# Altium schematic sheet Sheet1.SchDoc
size A3; SheetNumber: 1; SheetTotal: 1
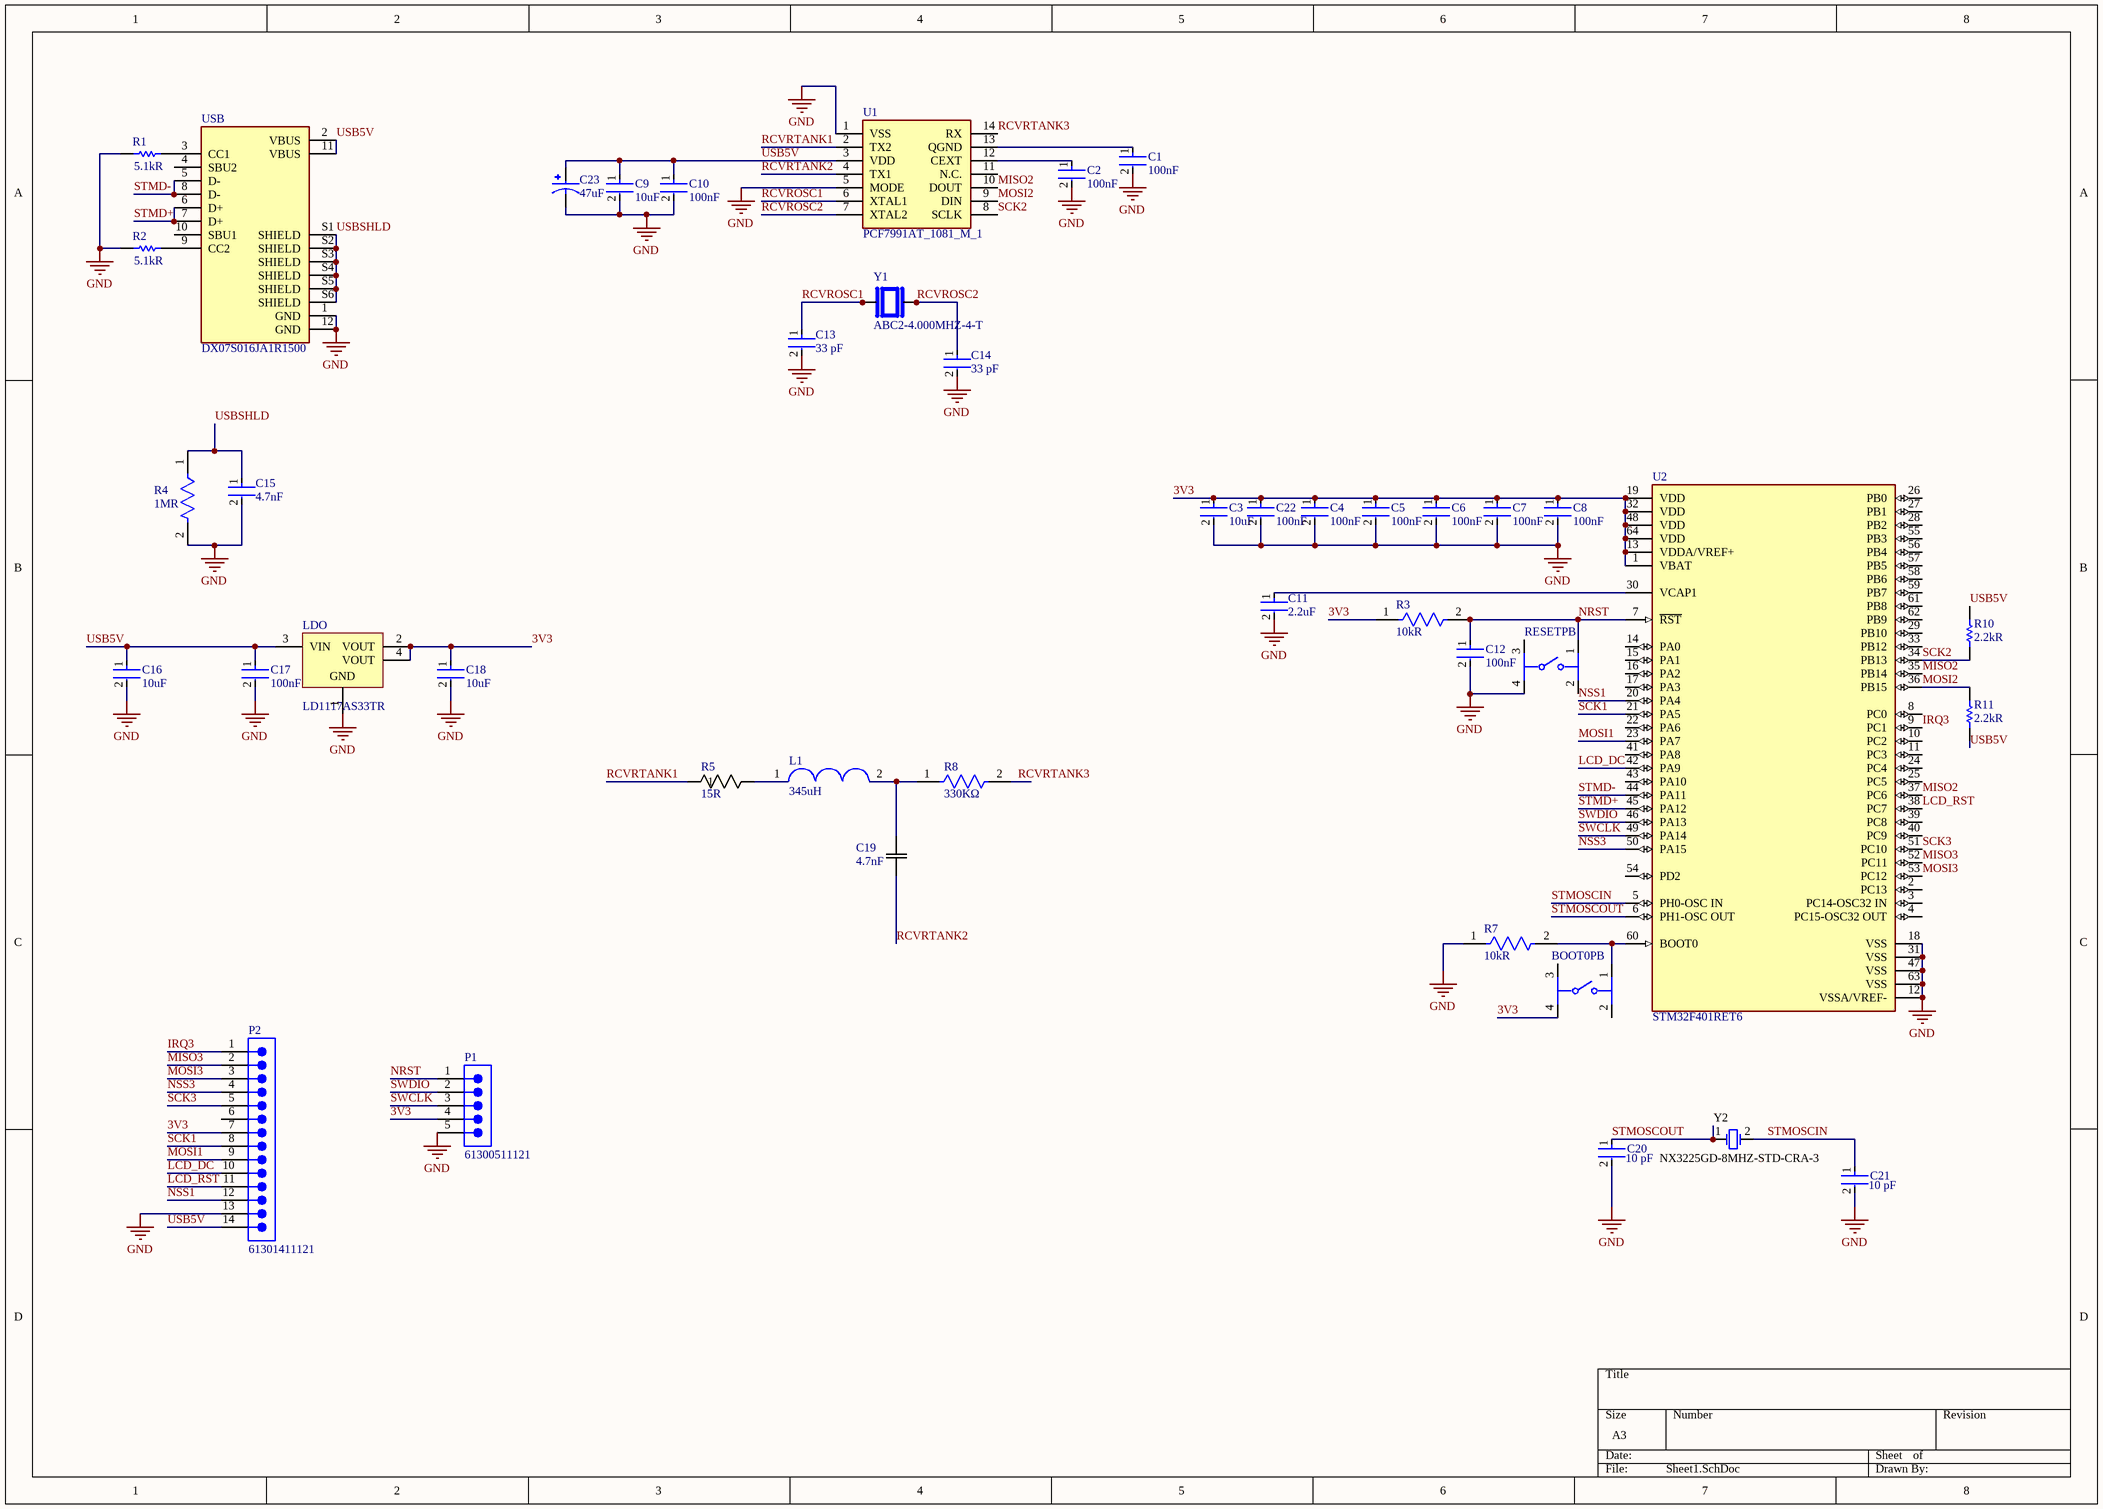
[diagram p0: Sheet1.SchDoc]

## Parts
BOOT0PB  PTS647SM38SMTR2LFS  [FP-PTS647SM38SMTR2LFS-MFG]  (value not drawn)
C1  Capacitance: 100nF  [FP-C0603C-CF-MFG]  (hidden comment: C0603C104K5RACTU)
C2  Capacitance: 100nF  [FP-C0603C-CF-MFG]  (hidden comment: C0603C104K5RACTU)
C3  Capacitance: 10uF  [FP-GRM188-0_2-IPC_C]  (hidden comment: GRM188R6YA106MA73D)
C4  Capacitance: 100nF  [FP-C0603C-CF-MFG]  (hidden comment: C0603C104K5RACTU)
C5  Capacitance: 100nF  [FP-C0603C-CF-MFG]  (hidden comment: C0603C104K5RACTU)
C6  Capacitance: 100nF  [FP-C0603C-CF-MFG]  (hidden comment: C0603C104K5RACTU)
C7  Capacitance: 100nF  [FP-C0603C-CF-MFG]  (hidden comment: C0603C104K5RACTU)
C8  Capacitance: 100nF  [FP-C0603C-CF-MFG]  (hidden comment: C0603C104K5RACTU)
C9  Capacitance: 10uF  [FP-GRM188-0_2-IPC_C]  (hidden comment: GRM188R6YA106MA73D)
C10  Capacitance: 100nF  [FP-C0603C-CF-MFG]  (hidden comment: C0603C104K5RACTU)
C11  Capacitance: 2.2uF  [FP-CL10-IPC_A]  (hidden comment: CL10A225KO8NNNC)
C12  Capacitance: 100nF  [FP-C0603C-CF-MFG]  (hidden comment: C0603C104K5RACTU)
C13  value 33 pF  [FP-C0603C-CF-MFG]  (hidden comment: C0603C330J5GACTU)
C14  value 33 pF  [FP-C0603C-CF-MFG]  (hidden comment: C0603C330J5GACTU)
C15  Capacitance: 4.7nF  [FP-GRM188-0_1-e0_2_0_5-MFG]  (hidden comment: GRM1885C1H472JA01D)
C16  Capacitance: 10uF  [FP-GRM188-0_2-IPC_C]  (hidden comment: GRM188R6YA106MA73D)
C17  Capacitance: 100nF  [FP-C0603C-CF-MFG]  (hidden comment: C0603C104K5RACTU)
C18  Capacitance: 10uF  [FP-GRM188-0_2-IPC_C]  (hidden comment: GRM188R6YA106MA73D)
C19  Parameter 1: 4.7nF  [CAPC340180_110N_KEM]  (hidden comment: C1206C472FBGACTU)
C20  Capacitance: 10 pF  [FP-C0603C-CF-MFG]  (hidden comment: C0603C100J5GACTU)
C21  Capacitance: 10 pF  [FP-C0603C-CF-MFG]  (hidden comment: C0603C100J5GACTU)
C22  Capacitance: 100nF  [FP-C0603C-CF-MFG]  (hidden comment: C0603C104K5RACTU)
C23  value 47uF  [CAP_EEEFK1C470P]  (hidden comment: EEEFK1C470P)
L1  Parameter 1: 345uH  [CP-345UH-ID20]  (hidden comment: CP-345UH-ID20)
LDO  LD1117AS33TR  [SOT-223_M]
P1  61300511121  [61300511121]
P2  61301411121  [61301411121]
R1  Parameter 1: 5.1kR  [RESC1608X55X25ML10T15]  (hidden comment: RC0603FR-075K1L)
R2  Parameter 1: 5.1kR  [RESC1608X55X25ML10T15]  (hidden comment: RC0603FR-075K1L)
R3  Resistance: 10kR  [FP-RC0603-0_55-IPC_C]  (hidden comment: RC0603FR-0710KL)
R4  Resistance: 1MR  [FP-ERJ3EK-IPC_C]  (hidden comment: ERJ-3EKF1004V)
R5  Parameter 1: 15R  [RES_352115RFT_TEC]  (hidden comment: 352115RFT)
R7  Resistance: 10kR  [FP-RC0603-0_55-IPC_C]  (hidden comment: RC0603FR-0710KL)
R8  Resistance: 330KΩ  [FP-CRGCQ1206-IPC_C]  (hidden comment: CRGCQ1206F330K)
R10  Resistance: 2.2kR  [RESC1608X55X25LL10T15]  (hidden comment: RC0603FR-072K2L)
R11  Resistance: 2.2kR  [RESC1608X55X25LL10T15]  (hidden comment: RC0603FR-072K2L)
RESETPB  PTS647SM38SMTR2LFS  [FP-PTS647SM38SMTR2LFS-MFG]  (value not drawn)
U1  PCF7991AT_1081_M_1  [SOIC127P600X175-14N]
U2  STM32F401RET6  [FP-LQFP64-5W-MFG]
USB  DX07S016JA1R1500  [JAE_DX07S016JA1R1500]
Y1  ABC2-4.000MHZ-4-T  [XTAL_ABC2-4.000MHZ-4-T]
Y2  NX3225GD-8MHZ-STD-CRA-3  [NDK-NX3225GD-8MHZ-STD-CRA-3_V]

## Nets
GND: C1.2 C2.2 C3.2 C4.2 C5.2 C6.2 C7.2 C8.2 C9.2 C10.2 C11.2 C12.2 C13.2 C14.2 C15.2 C16.2 C17.2 C18.2 C20.2 C21.2 C22.2 C23.2 LDO.1(GND) P1.5 P2.13 R1.1 R2.1 R4.2 R7.1 RESETPB.4 U1.1(VSS) U1.5(MODE) U2.12(VSSA/VREF-) U2.18(VSS) U2.31(VSS) U2.47(VSS) U2.63(VSS) USB.1(GND) USB.12(GND)
3V3: BOOT0PB.4 C3.1 C4.1 C5.1 C6.1 C7.1 C8.1 C18.1 C22.1 LDO.2(VOUT) LDO.4(VOUT) P1.4 P2.7 R3.1 U2.1(VBAT) U2.13(VDDA/VREF+) U2.19(VDD) U2.32(VDD) U2.48(VDD) U2.64(VDD)
IRQ3: P2.1 U2.9(PC1)
LCD_DC: P2.10 U2.42(PA9)
LCD_RST: P2.11 U2.38(PC7)
MISO2: U1.10(DOUT) U2.35(PB14) U2.37(PC6)
MISO3: P2.2 U2.52(PC11)
MOSI1: P2.9 U2.23(PA7)
MOSI2: R11.2 U1.9(DIN) U2.36(PB15)
MOSI3: P2.3 U2.53(PC12)
NRST: C12.1 P1.1 R3.2 RESETPB.1 U2.7(~{RST})
NSS1: P2.12 U2.20(PA4)
NSS3: P2.4 U2.50(PA15)
RCVROSC1: C13.1 U1.6(XTAL1) Y1.1 Y1.4
RCVROSC2: C14.1 U1.7(XTAL2) Y1.2 Y1.3
RCVRTANK1: R5.1 U1.2(TX2)
RCVRTANK2: C19.1 U1.4(TX1)
RCVRTANK3: R8.2 U1.14(RX)
SCK1: P2.8 U2.21(PA5)
SCK2: R10.1 U1.8(SCLK) U2.34(PB13)
SCK3: P2.5 U2.51(PC10)
STMD+: U2.45(PA12) USB.6(D+) USB.7(D+)
STMD-: U2.44(PA11) USB.5(D-) USB.8(D-)
STMOSCIN: C21.1 U2.5(PH0-OSC_IN) Y2.2
STMOSCOUT: C20.1 U2.6(PH1-OSC_OUT) Y2.1
SWCLK: P1.3 U2.49(PA14)
SWDIO: P1.2 U2.46(PA13)
USB5V: C9.1 C10.1 C16.1 C17.1 C23.1 LDO.3(VIN) P2.14 R10.2 R11.1 U1.3(VDD) USB.2(VBUS) USB.11(VBUS)
USBSHLD: C15.1 R4.1 USB.S1(SHIELD) USB.S2(SHIELD) USB.S3(SHIELD) USB.S4(SHIELD) USB.S5(SHIELD) USB.S6(SHIELD)
NetBOOT0PB_1: BOOT0PB.1 R7.2 U2.60(BOOT0)
NetC1_1: C1.1 U1.13(QGND)
NetC2_1: C2.1 U1.12(CEXT)
NetC11_1: C11.1 U2.30(VCAP1)
NetC19_2: C19.2 L1.2 R8.1
NetL1_1: L1.1 R5.2
NetR1_2: R1.2 USB.3(CC1)
NetR2_2: R2.2 USB.9(CC2)

Not connected (* = marked no-connect by the designer): BOOT0PB 2 3; P2 6; RESETPB 2 3; U1 11(N.C.); U2 2(PC13) 3(PC14-OSC32_IN) 4(PC15-OSC32_OUT) 8(PC0) 10(PC2) 11(PC3) 14(PA0) 15(PA1) 16(PA2) 17(PA3) 22(PA6) 24(PC4) 25(PC5) 26(PB0) 27(PB1) 28(PB2) 29(PB10) 33(PB12) 39(PC8) 40(PC9) 41(PA8) 43(PA10) 54(PD2) 55(PB3) 56(PB4) 57(PB5) 58(PB6) 59(PB7) 61(PB8) 62(PB9); USB 4(SBU2) 10(SBU1)

## Library data of the parts
BOOT0PB RESETPB = CMP-10040-000031-1: TACT 4.5 X 4.5, 3.8 MM H, 1.8N,; Operating Force: 180gf; Throw Configuration: SPST; Mechanical Life: 100000Cycles; Ratings: IP40; Switch Travel: 0.25mm; Switch Function: Off-Mom; Actuator Type: Standard; Illumination Type: Non-Illuminated; Max Operating Temperature: 70°C; Packaging: Cut Tape; Min Operating Temperature: -20°C; Mount: Surface Mount; Termination: Gull Wing
C1 C2 C4-C8 C10 C12 C17 C22 = CMP-2006-03061-2: CAP CER 0.1UF 50V X7R 0603; Manufacturer: KEMET; Tolerance: 0.1; Temperature Coefficient: 30ppm/°C; Material: Ceramic; Automotive Grade: Grade 1; Value: 0.10 μF; Temperature: -55°C to +125°C; RoHS: TRUE; Temperature Range High: +125°C; Lead Free: Yes; Octopart: https://octopart.com/c0603c104k5ractu-kemet-139244; Digikey Description: CAP CER 0.1UF 50V X7R 0603; Category: Cap; Package: C0603C-CF; ComponentLink2Description: Datasheet; Temperature Range Low: -55°C; Device Class L1: Passive Components; Voltage Rating: 50 V; Automotive: Yes; Device Class L3: Ceramic Capacitors; ComponentLink2URL: https://api.kemet.com/component-edge/download/datasheet/C0603C100J5GACAUTO.pdf; Device Class L2: Capacitors; Manufacturer Part Number: C0603C104K5RACTU; Temperature Characteristic: X7R; Height: 0.87mm
C3 C9 C16 C18 = CMP-06035-045466-1: Chip Multilayer Ceramic Capacitors for General Purpose, 0603, 10uF, X5R, 15%, 20%, 35V; Case Code (Imperial): 0603; Voltage Rating (DC): 35V; Width: 0.031inch; Dielectric: X5R; Voltage Rating: 35V; Min Operating Temperature: -55°C; Thickness: 0.039inch; Mount: Surface Mount; Case/Package: 0603; Length: 0.063inch; Max Operating Temperature: 85°C; Packaging: Tape and Reel; Tolerance: 20%; Case Code (Metric): 1608
C11 = CMP-13271-000835-1: Cap Ceramic 2.2uF 16V X5R ±10% Pad SMD 0603 +85°C T/R; Case Code (Metric): 1608; Height: 0.8mm; Case/Package: 0603; Depth: 0.8mm; Voltage Rating: 16V; Case Code (Imperial): 0603; Length: 1.6mm; Packaging: Tape and Reel; Material: Ceramic; Lead Free: Lead Free; Max Operating Temperature: 85°C; Contact Plating: Tin; Thickness: 0.035inch; Radiation Hardening: No; Tolerance: 10%; Min Operating Temperature: -55°C; Voltage: 16V; Dielectric: X5R; Mount: Surface Mount; Package Quantity: 4000; Width: 0.031inch; Voltage Rating (DC): 16V
C13 C14 = CMP-2006-03168-3: Capacitor; Ceramic; Cap; 33.0pF; Tol 5%; SMT; Vol-Rtg 50V; C0G; Tape and Reel; Manufacturer: KEMET; Tolerance: 0.05; Temperature Coefficient: 30ppm/°C; Automotive Grade: Grade 1; Manufacturer Part Number: C0603C330J5GACTU; Height: 0.87mm; Digikey Description: Capacitor; Ceramic; Cap; 33.0pF; Tol 5%; SMT; Vol-Rtg 50V; C0G; Tape and Reel; Material: Ceramic; RoHS: TRUE; Device Class L1: Passive Components; Temperature Characteristic: C0G; Capacitance: 33 pF; Voltage Rating: 50 V; Automotive: Yes; Temperature Range High: +125°C; ComponentLink2Description: Datasheet; ComponentLink2URL: https://api.kemet.com/component-edge/download/datasheet/C0603C100J5GACAUTO.pdf; Category: Cap; Mouser Description: Capacitor; Ceramic; Cap; 33.0pF; Tol 5%; SMT; Vol-Rtg 50V; C0G; Tape and Reel; Temperature Range Low: -55°C; Octopart: https://octopart.com/c0603c330j5gactu-kemet-87666; Temperature: -55°C to +125°C; Lead Free: Yes; Device Class L3: Ceramic Capacitors; Package: C0603C-CF; Device Class L2: Capacitors
C15 = CMP-2006-02564-2: Chip Multilayer Ceramic Capacitors for General Purpose, 0603, 4700pF, C0G, 30ppm/°C, 5%, 50V; Case Code (Imperial): 0603; Width: 0.8mm; Package Quantity: 4000; Termination: SMD/SMT; Lead Free: Lead Free; Voltage Rating (DC): 50V; Dielectric: C0G; Height: 0.8mm; Tolerance: 5%; Thickness: 0.035inch; Min Operating Temperature: -55°C; Voltage Rating: 50V; Mount: Surface Mount; Max Operating Temperature: 125°C; Case Code (Metric): 1608; REACH SVHC: No SVHC; Material: Ceramic; Length: 1.6mm; Packaging: Tape and Reel; Case/Package: 0603
C19 = CMP-001-00090-1: SMD Comm C0G HV, Ceramic, 4700 pF, 1%, 630 VDC, C0G, SMD, MLCC, Ultra-Stable, Low Loss, Class I, 1206; Manufacturer_Name: Kemet; Copyright: Copyright (C) 2026 Ultra Librarian. All rights reserved.; Source: C1206C472FBGACTU.SchLib; Datasheet: https://content.kemet.com/datasheets/KEM_C1009_C0G_HV_SMD.pdf; Design Item ID: C1206C472FBGACTU; Manufacturer_Part_Number: C1206C472FBGACTU
C20 C21 = CMP-2006-02999-3: CAP CER 10PF 50V C0G/NP0 0603; Manufacturer: KEMET; Temperature Coefficient: 30ppm/°C; Temperature Characteristic: C0G; Material: Ceramic; Automotive Grade: Grade 1; Tolerance: 0.05; Device Class L2: Capacitors; Height: 0.87mm; Value: 10 pF; Package: C0603C-CF; Digikey Description: CAP CER 10PF 50V C0G/NP0 0603; Lead Free: Yes; Voltage Rating: 50 V; Mouser Description: Multilayer Ceramic Capacitors MLCC - SMD/SMT 50volts 10pF C0G 5%; Manufacturer Part Number: C0603C100J5GACTU; Device Class L1: Passive Components; Octopart: https://octopart.com/c0603c100j5gactu-kemet-138281; Category: Cap; Temperature: -55°C to +125°C; ComponentLink2URL: https://api.kemet.com/component-edge/download/datasheet/C0603C100J5GACAUTO.pdf; Temperature Range High: +125°C; ComponentLink2Description: Datasheet; Automotive: Yes; Device Class L3: Ceramic Capacitors; Temperature Range Low: -55°C; RoHS: TRUE
C23 = EEEFK1C470P: 47ÂµF 16V Aluminum Electrolytic Capacitors Radial, Can - SMD 2000 Hrs @ 105Â°C; MF: Panasonic Electronic; MP: EEE-FK1C470P; SnapEDA_Link: https://www.snapeda.com/parts/EEE-FK1C470P/Panasonic/view-part/?ref=snap; Package: RADIAL-2 Panasonic; Check_prices: https://www.snapeda.com/parts/EEE-FK1C470P/Panasonic/view-part/?ref=eda
LDO = CMP-0244-00316-1: 1A, Low Drop Positive Voltage Regulator, 3.3V, 4-Pin SOT-223, Tape and Reel; ComponentLink1Description: Manufacturer URL; DatasheetVersion: 2/12/2011; PackageVersion: 2010; ComponentLink1URL: http://www.st.com; ComponentLink2Description: Datasheet; ComponentLink2URL: http://www.st.com/internet/com/TECHNICAL_RESOURCES/TECHNICAL_LITERATURE/DATASHEET/CD00002116.pdf; PackageDescription: 4-Pin SOT-223 Package, 6.5 x 3.5 mm Body, 2.3 mm Pitch, 7 mm Lead Span; PackageReference: SOT-223
P1 = CMP-1502-01068-4: THT Vertical Pin Header WR-PHD, Pitch 2.54 mm, Single Row, 5 pins; Number of Contacts: 5; Connector Type: Male Pin; Operating Supply Voltage: 250V; Contact Resistance: 20mΩ; Gender: Male; Pitch: 2.54mm; Current Rating: 3A; Min Operating Temperature: -40°C; Contact Material: Gold; Color: Black; RoHS: Compliant; Number of Rows: 1; Lead Free: Lead Free; Height: 8.89mm; Contact Plating: Gold; Number of Pins: 5; Orientation: Vertical; Voltage Rating: 250V; Packaging: Bulk; Number of Positions: 5; Max Operating Temperature: 105°C; Termination: Solder; Lead Pitch: 2.54mm; Contact Mating Length: 5.9944mm; Mount: Through Hole
P2 = CMP-1502-01091-4: THT Vertical Pin Header WR-PHD, Pitch 2.54 mm, Single Row, 14 pins; Number of Positions: 14; Current Rating: 3A; Operating Supply Voltage: 250V; Contact Resistance: 20mΩ; Pitch: 2.54mm; Connector Type: Male Pin; Gender: Male; Orientation: Vertical; RoHS: Compliant; Packaging: Bulk; Lead Pitch: 2.54mm; Contact Material: Gold; Contact Plating: Gold; Min Operating Temperature: -40°C; Number of Rows: 1; Contact Mating Length: 5.9944mm; Color: Black; Voltage Rating: 250V; Termination: Solder; Max Operating Temperature: 105°C; Mount: Through Hole; Lead Free: Lead Free; Number of Pins: 14; Height: 8.89mm; Number of Contacts: 14
R1 R2 = CMP-2000-04091-1: Manufacturer: Yageo; Part Number: RC0603FR-075K1L
R3 R7 = CMP-2100-03664-2: RES 10K OHM 1% 1/10W 0603; Voltage Rating: 75V; Voltage Rating (DC): 50V; Power Rating: 100mW; Temperature Coefficient: 100ppm/°C; Depth: 0.8mm; Termination: SMD/SMT; Resistor Type: Thick Film; Series: RC; Construction: Rectangular; Features: Moisture Resistant; Packaging: Tape and Reel; Min Operating Temperature: -55°C; Number of Terminations: 2; Lead Pitch: 0.3mm; RoHS Compliant: Yes; Case/Package: 0603; Resistance Tolerance: 1%; Military Standard: Not; Weight: 7.1E-05oz; Number of Pins: 2; Tolerance: 1%; Length: 1.6mm; Case Code (Imperial): 0603; Lead Free: Lead Free; Width: 0.8mm; Max Power Dissipation: 100mW; Height: 0.45mm; Max Operating Temperature: 155°C; Case Code (Metric): 1608; Size Code: 0603
R4 = CMP-1012-00849-3: RES SMD 1M OHM 1% 1/10W 0603; Voltage Rating: 75V; Temperature Coefficient: 100ppm/°C; Power Rating: 100mW; REACH SVHC: No SVHC; Radiation Hardening: No; Features: Automotive AEC-Q200; Case Code (Metric): 1608; Resistance Tolerance: 1%; Case/Package: 0603; Termination: SMD/SMT; Max Operating Temperature: 155°C; Tolerance: 1%; Size Code: 0603; Case Code (Imperial): 0603; Min Operating Temperature: -55°C; Number of Pins: 2; Mount: Surface Mount; Package Quantity: 1; Military Standard: Not; Voltage Rating (DC): 75V; Depth: 0.8mm; Packaging: Tape and Reel; Width: 0.8mm; Number of Terminations: 2; Length: 1.6mm; Height: 0.022inch; RoHS Compliant: Yes; Resistor Type: Thick Film; Contact Plating: Tin; Lead Free: Lead Free; Series: ERJ; Construction: Rectangular; Max Power Dissipation: 100mW
R5 = CMP-009-00183-1: 3521 15R 1% 2W; Manufacturer_Name: TE Connectivity; Manufacturer_Part_Number: 352115RFT; Datasheet: https://www.te.com/commerce/DocumentDelivery/DDEController?Action=srchrtrv&DocNm=9-1773463-5&DocType=Data+Sheet&DocLang=English&PartCntxt=2176070-5&DocFormat=pdf; Source: 352115RFT.SchLib; Design Item ID: 352115RFT; Copyright: Copyright (C) 2026 Ultra Librarian. All rights reserved.
R8 = CMP-03211-007819-1: CRGCQ1206 330KΩ 0.25W 1% ±100ppm/°C 200V; Manufacturer: TE Connectivity; Tolerance: 0.01; Manufacturer Part Number: CRGCQ1206F330K; Device Class L3: Chip SMD Resistors; ComponentLink2URL: https://www.te.com/commerce/DocumentDelivery/DDEController?Action=showdoc&DocId=Data+Sheet%7F1773204-3%7F1%7Fpdf%7FEnglish%7FENG_DS_1773204-3_1.pdf%7F4-2176347-1264; Composition: Thick Film; Voltage Rating: 200V; Device Class L1: Passive Components; Package: CRGCQ1206; Ipc Land Pattern Name: RESC310155X55; Lead Free: Yes; Automotive: Yes; Octopart: https://octopart.com/crgcq1206f330k-te+connectivity-91018273; Temperature Range High: +155°C; Series: CRGCQ; Temperature Range Low: -55°C; Temperature Coefficient: ±100ppm/°C; Category: Res; RoHS: TRUE; Automotive Grade: Grade 1255; Temperature: -55°C to +155°C; Value: 330KΩ; Height: 0.65mm; ComponentLink2Description: Datasheet; Power Rating: 0.25W; Ambient Temperature Range High: +70°C; Device Class L2: Resistors
R10 R11 = CMP-2000-06934-1: Thick Film Resistor, 2.2 KOhm, 100 mW, 50 V, +/- 1%, -55 to 155 degC, 2-Pin SMD (0603), RoHS, Tape and Reel; Manufacturer: Yageo; Temperature Coefficient: 100PPM/C; Voltage Rating: 50V; Power Rating: 100mW; Tolerance: 1%; Datasheet Version: Rev. 7, 05/2017; Case Code - mm: 1608; Series: RC; Mounting Technology: SurfaceMount; Package Description: 2-Pin Surface Mount Device, Body 1.6 x 0.8 mm; Case Code - in: 0603; Package Reference: 0603; Product: ThickFilmResistorsGeneralPurpose; Manufacturer URL: http://www.yageo.com/; Termination Style: SMD/SMT; Operating Temperature Range: -55Cto+155C; Datasheet URL: http://www.yageo.com/documents/recent/PYu-RC_Group_51_RoHS_L_7.pdf; Packaging: Reel
U1 = CMP-081-000000-1: IC REMOTE KEYLESS ENTRY 14SOIC; Manufacturer_Name: NXP; Manufacturer_Part_Number: PCF7991AT/1081/M:1; Geometry.Height: 1.75mm; Datasheet Link: https://www.farnell.com/datasheets/2353677.pdf; Design Item ID: PCF7991AT_1081_M_1; Arrow Part Number: *; Mouser Price/Stock: *; Mouser Part Number: *; Arrow Price/Stock: *; Source: PCF7991AT_1081_M_1.SchLib
U2 = CMP-12105-000004-1: IC MCU 32BIT 512KB FLASH 64LQFP; Manufacturer: STMicroelectronics; Memory Size: 512KBytes; Number Of Cores: 1; Max Junction Temp: +105°C; Ram Size: 96KBytes; Number Of Adc Channels: 12; Number Of Pwm Channels: 23; Standoff Height: 0.05mm; Frequency: 84MHz; Number Of Timers/Counters: 8; Number Of I/Os: 50; Interface: I2C,SPI,USART,USB,IrDA,I2S,SMBus,Other; Number Of I2C Channels: 3; Max Supply Voltage: 3.6V; Data Bus Width: 32bits; Core Architecture: ARM Cortex-M4; Min Supply Voltage: 1.65V; Category: IC; Device Class L3: Microcontrollers; ComponentLink2URL: https://www.st.com/resource/en/datasheet/stm32f401re.pdf; RoHS: TRUE; Temperature Range High: +105°C; Device Class L2: Embedded Processors and Controllers; ComponentLink2Description: Datasheet; Temperature Range Low: -40°C; Digikey Description: IC MCU 32BIT 512KB FLASH 64LQFP; Package: LQFP64-5W; Manufacturer Part Number: STM32F401RET6; Number Of A/D Converters: 1; Ipc Land Pattern Name: QFP50P1200X1200X160-64; Automotive: No; Ambient Temperature Range Low: -40°C; Height: 1.6mm; Octopart: https://octopart.com/stm32f401ret6-stmicroelectronics-34185993; Ambient Temperature Range High: +85°C; Device Class L1: Integrated Circuits (ICs); Temperature: -40°C to +105°C; Number Of Spi Channels: 3; Number Of Uart Channels: 3; Memory Type: FLASH; Number Of Usb Channels: 1; Lead Free: Yes; Mouser Description: ARM Microcontrollers - MCU 16/32-BITS MICROS
USB = DX07S016JA1R1500: USB-C (USB TYPE-C) USB 2.0 Receptacle Connector 24 (16+8 Dummy) Position Surface Mount, Right Angle; Through Hole; Package: None; Value: *; Price: None; MP: DX07S016JA1R1500; Availability: Unavailable
Y2 = CMP-2000-07595-1: Crystal Unit, 8 MHz, 8 pF, -40 to 150 degC, 2-Pin SMD, RoHS, Tape and Reel; Manufacturer: NDK; Load Capacitance: 8pF; ESR (Equivalent Series Resistance): 500Ohm; Frequency Tolerance: 50ppm; Frequency Stability: 150ppm; Frequency: 8MHz; Case/Package: SMD/SMT; Datasheet Version: 11/2016; Min Operating Temperature: -40degC; Packaging: TapeandReel; Width: 0.098inch; Package Quantity: 3000; Number of Pins: 2; Package Description: 2-Pin Surface Mount Device, Body 3.2 x 2.5 mm; RoHSCompliant: True; Package Reference: NX3225GD-8MHZ-STD-CRA-3; Datasheet URL: http://www.ndk.com/images/products/catalog/c_NX3225GD-STD-CRA-3_e.pdf; Mounting Technology: SurfaceMount; Length: 0.126inch; Mount: SurfaceMount; Manufacturer URL: http://www.ndk.com/en/; Max Operating Temperature: 150degC; Height: 0.039inch
Y1 = ABC2-4.000MHZ-4-T: Availability: Unavailable; Price: None; Package: None; Value: *; MP: ABC2-4.000MHZ-4-T